# Altium schematic sheet IMX6DL_control.SchDoc
size A4
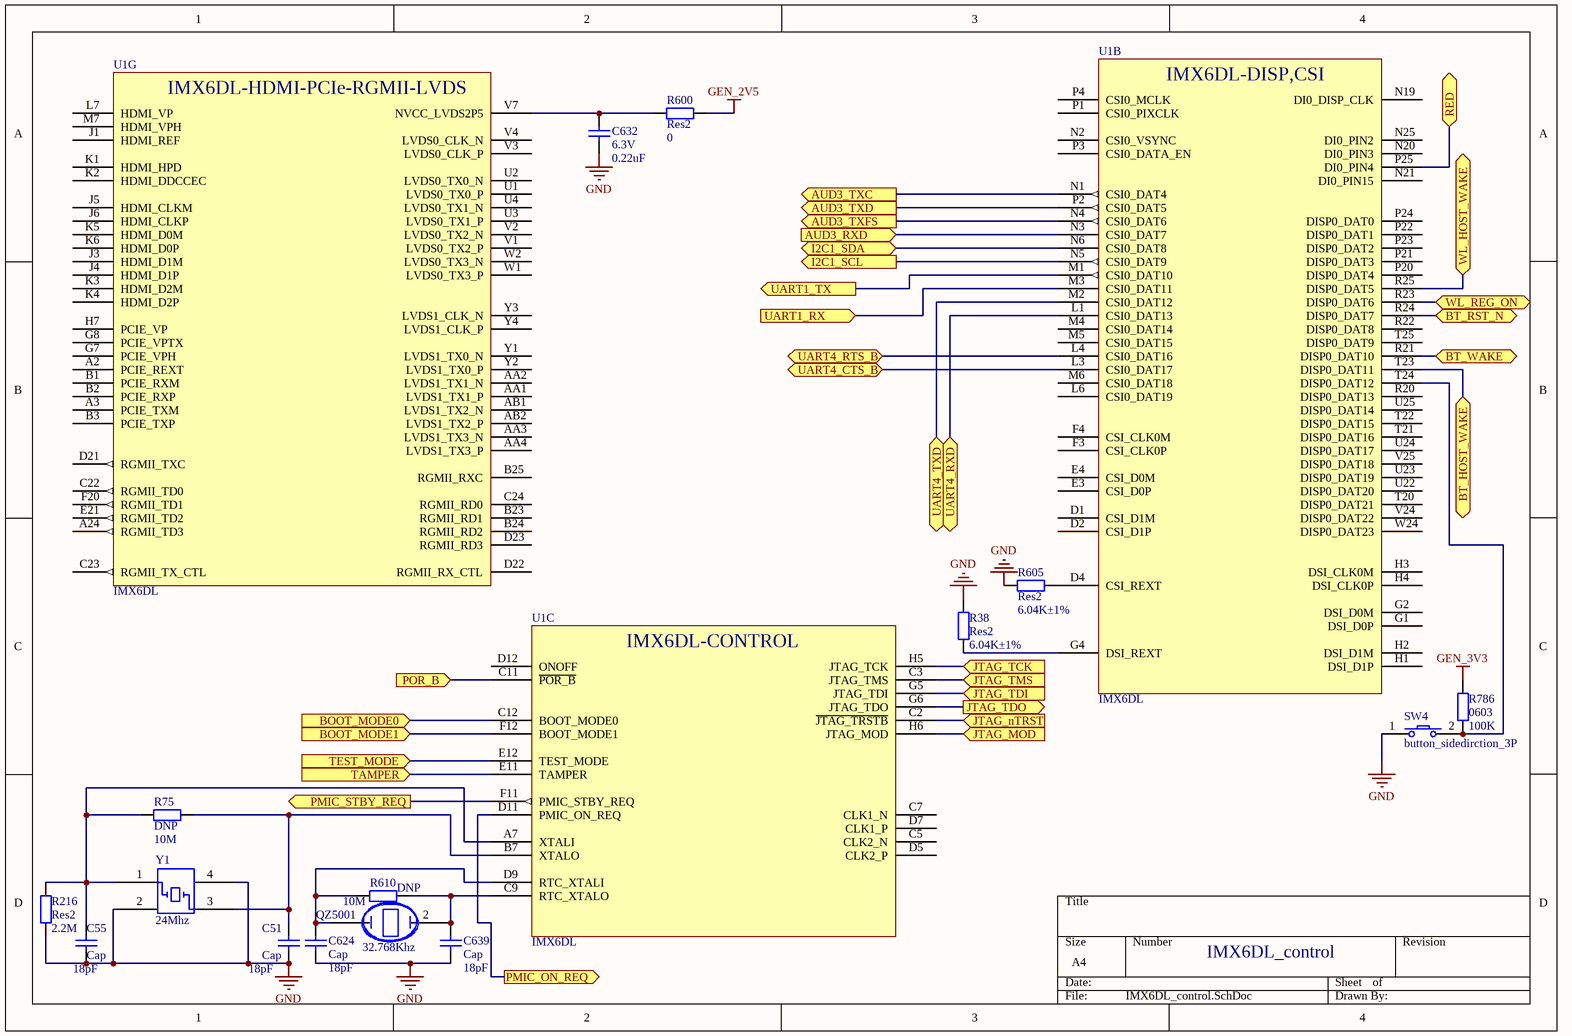
[diagram p0: IMX6DL_control.SchDoc]

## Parts
C51  Cap  value 18pF  [0402]
C55  Cap  value 18pF  [0402]
C624  Cap  value 18pF  [0402]
C632  6.3V  value 0.22uF  [0201]
C639  Cap  value 18pF  [0402]
QZ500  32.768Khz  [XTAL32.768Khz-SMT]
R38  Res2  value 6.04K±1%  [0402]
R75  DNP  value 10M  [0402]
R216  Res2  value 2.2M  [0402]
R600  Res2  value 0  [0402]
R605  Res2  value 6.04K±1%  [0402]
R610  DNP  value 10M  [0402]
R786  0603  value 100K  [0603]
SW4  button_sidedirction_3P  [button_sidedirction_3P 4.5X4.5]
U1  IMX6DL  [IMX6DL-BGA624x25]  (parts B,C,G of 8)
Y1  24Mhz  [XTL571300LLI24.000-10TR]

## Ports
AUD3_RXD (in), AUD3_TXC (out), AUD3_TXD (out), AUD3_TXFS (out), BOOT_MODE0 (in), BOOT_MODE1 (in), BT_HOST_WAKE, BT_RST_N, BT_WAKE, I2C1_SCL (out), I2C1_SDA (bidir), JTAG_MOD (in), JTAG_nTRST (in), JTAG_TCK (in), JTAG_TDI (in), JTAG_TDO (out), JTAG_TMS (in), PMIC_ON_REQ (out), PMIC_STBY_REQ (out), POR_B (in), RED, TAMPER (in), TEST_MODE (in), UART1_RX (in), UART1_TX (out), UART4_CTS_B, UART4_RTS_B, UART4_RXD, UART4_TXD, WL_HOST_WAKE, WL_REG_ON

## Nets
GEN_2V5: R600.2
GEN_3V3: R786.2
GND: C51.1 C55.1 C624.1 C632.1 C639.1 R38.2 R216.1 R605.1 SW4.1 Y1.2 Y1.4
AUD3_RXD: U1.N3(CSI0_DAT7) ; port AUD3_RXD
AUD3_TXC: U1.N1(CSI0_DAT4) ; port AUD3_TXC
AUD3_TXD: U1.P2(CSI0_DAT5) ; port AUD3_TXD
AUD3_TXFS: U1.N4(CSI0_DAT6) ; port AUD3_TXFS
BOOT_MODE0: U1.C12(BOOT_MODE0) ; port BOOT_MODE0
BOOT_MODE1: U1.F12(BOOT_MODE1) ; port BOOT_MODE1
BT_HOST_WAKE: U1.T23(DISP0_DAT11) ; port BT_HOST_WAKE
BT_RST_N: U1.R24(DISP0_DAT7) ; port BT_RST_N
BT_WAKE: U1.R21(DISP0_DAT10) ; port BT_WAKE
I2C1_SCL: U1.N5(CSI0_DAT9) ; port I2C1_SCL
I2C1_SDA: U1.N6(CSI0_DAT8) ; port I2C1_SDA
JTAG_MOD: U1.H6(JTAG_MOD) ; port JTAG_MOD
JTAG_nTRST: U1.C2(~{JTAG_TRSTB}) ; port JTAG_nTRST
JTAG_TCK: U1.H5(JTAG_TCK) ; port JTAG_TCK
JTAG_TDI: U1.G5(JTAG_TDI) ; port JTAG_TDI
JTAG_TDO: U1.G6(JTAG_TDO) ; port JTAG_TDO
JTAG_TMS: U1.C3(JTAG_TMS) ; port JTAG_TMS
PMIC_ON_REQ: U1.D11(PMIC_ON_REQ) ; port PMIC_ON_REQ
PMIC_STBY_REQ: U1.F11(PMIC_STBY_REQ) ; port PMIC_STBY_REQ
POR_B: U1.C11(~{POR_B}) ; port POR_B
RED: U1.P25(DI0_PIN4) ; port RED
TAMPER: U1.E11(TAMPER) ; port TAMPER
TEST_MODE: U1.E12(TEST_MODE) ; port TEST_MODE
UART1_RX: U1.M3(CSI0_DAT11) ; port UART1_RX
UART1_TX: U1.M1(CSI0_DAT10) ; port UART1_TX
UART4_CTS_B: U1.L3(CSI0_DAT17) ; port UART4_CTS_B
UART4_RTS_B: U1.L4(CSI0_DAT16) ; port UART4_RTS_B
UART4_RXD: U1.L1(CSI0_DAT13) ; port UART4_RXD
UART4_TXD: U1.M2(CSI0_DAT12) ; port UART4_TXD
WL_HOST_WAKE: U1.R25(DISP0_DAT5) ; port WL_HOST_WAKE
WL_REG_ON: U1.R23(DISP0_DAT6) ; port WL_REG_ON
NetC51_2: C51.2 R75.2 U1.B7(XTALO) Y1.3
NetC55_2: C55.2 R75.1 R216.2 U1.A7(XTALI) Y1.1
NetC624_2: C624.2 QZ500.1 R610.1 U1.D9(RTC_XTALI)
NetC632_2: C632.2 R600.1 U1.V7(NVCC_LVDS2P5)
NetC639_2: C639.2 QZ500.2 R610.2 U1.C9(RTC_XTALO)
NetR38_1: R38.1 U1.G4(DSI_REXT)
NetR605_2: R605.2 U1.D4(CSI_REXT)
NetR786_1: R786.1 SW4.2 U1.T24(DISP0_DAT12)

Not connected (* = marked no-connect by the designer): U1 A2(PCIE_REXT) A3(PCIE_TXM) A24(RGMII_TD3) AA1(LVDS1_TX1_P) AA2(LVDS1_TX1_N) AA3(LVDS1_TX3_N) AA4(LVDS1_TX3_P) AB1(LVDS1_TX2_N) AB2(LVDS1_TX2_P) B1(PCIE_RXM) B2(PCIE_RXP) B3(PCIE_TXP) B23(RGMII_RD1) B24(RGMII_RD2) B25(RGMII_RXC) C5(CLK2_N) C7(CLK1_N) C22(RGMII_TD0) C23(RGMII_TX_CTL) C24(RGMII_RD0) D1(CSI_D1M) D2(CSI_D1P) D5(CLK2_P) D7(CLK1_P) D12(ONOFF) D21(RGMII_TXC) D22(RGMII_RX_CTL) D23(RGMII_RD3) E3(CSI_D0P) E4(CSI_D0M) E21(RGMII_TD2) F3(CSI_CLK0P) F4(CSI_CLK0M) F20(RGMII_TD1) G1(DSI_D0P) G2(DSI_D0M) G7(PCIE_VPH) G8(PCIE_VPTX) H1(DSI_D1P) H2(DSI_D1M) H3(DSI_CLK0M) H4(DSI_CLK0P) H7(PCIE_VP) J1(HDMI_REF) J3(HDMI_D1M) J4(HDMI_D1P) J5(HDMI_CLKM) J6(HDMI_CLKP) K1(HDMI_HPD) K2(HDMI_DDCCEC) K3(HDMI_D2M) K4(HDMI_D2P) K5(HDMI_D0M) K6(HDMI_D0P) L6(CSI0_DAT19) L7(HDMI_VP) M4(CSI0_DAT14) M5(CSI0_DAT15) M6(CSI0_DAT18) M7(HDMI_VPH) N2(CSI0_VSYNC) N19(DI0_DISP_CLK) N20(DI0_PIN3) N21(DI0_PIN15) N25(DI0_PIN2) P1(CSI0_PIXCLK) P3(CSI0_DATA_EN) P4(CSI0_MCLK) P20(DISP0_DAT4) P21(DISP0_DAT3) P22(DISP0_DAT1) P23(DISP0_DAT2) P24(DISP0_DAT0) R20(DISP0_DAT13) R22(DISP0_DAT8) T20(DISP0_DAT21) T21(DISP0_DAT16) T22(DISP0_DAT15) T25(DISP0_DAT9) U1(LVDS0_TX0_P) U2(LVDS0_TX0_N) U3(LVDS0_TX1_P) U4(LVDS0_TX1_N) U22(DISP0_DAT20) U23(DISP0_DAT19) U24(DISP0_DAT17) U25(DISP0_DAT14) V1(LVDS0_TX2_P) V2(LVDS0_TX2_N) V3(LVDS0_CLK_P) V4(LVDS0_CLK_N) V24(DISP0_DAT22) V25(DISP0_DAT18) W1(LVDS0_TX3_P) W2(LVDS0_TX3_N) W24(DISP0_DAT23) Y1(LVDS1_TX0_N) Y2(LVDS1_TX0_P) Y3(LVDS1_CLK_N) Y4(LVDS1_CLK_P)

## Notes on the sheet
- IMX6DL_control
- (in symbol IMX6DL, part B) IMX6DL-DISP,CSI
- (in symbol IMX6DL, part C) IMX6DL-CONTROL
- (in symbol IMX6DL, part G) IMX6DL-HDMI-PCIe-RGMII-LVDS

## Library data of the parts
C51 C55 C624 C632 C639 = Cap: Capacitor; Published: 8-Jun-2000; LatestRevisionDate: 17-Jul-2002; LatestRevisionNote: Re-released for DXP Platform.; PackageReference: RAD-0.3; Publisher: Altium Limited
QZ500 = XTAL-32.768KHZ
R38 R75 R216 R600 R605 R610 R786 = Res2: Resistor; Published: 8-Jun-2000; LatestRevisionDate: 17-Jul-2002; LatestRevisionNote: Re-released for DXP Platform.; PackageReference: AXIAL-0.4; Publisher: Altium Limited
Y1 = XTAL